# Altium schematic sheet WX0.012.462DL.SchDoc
size A3
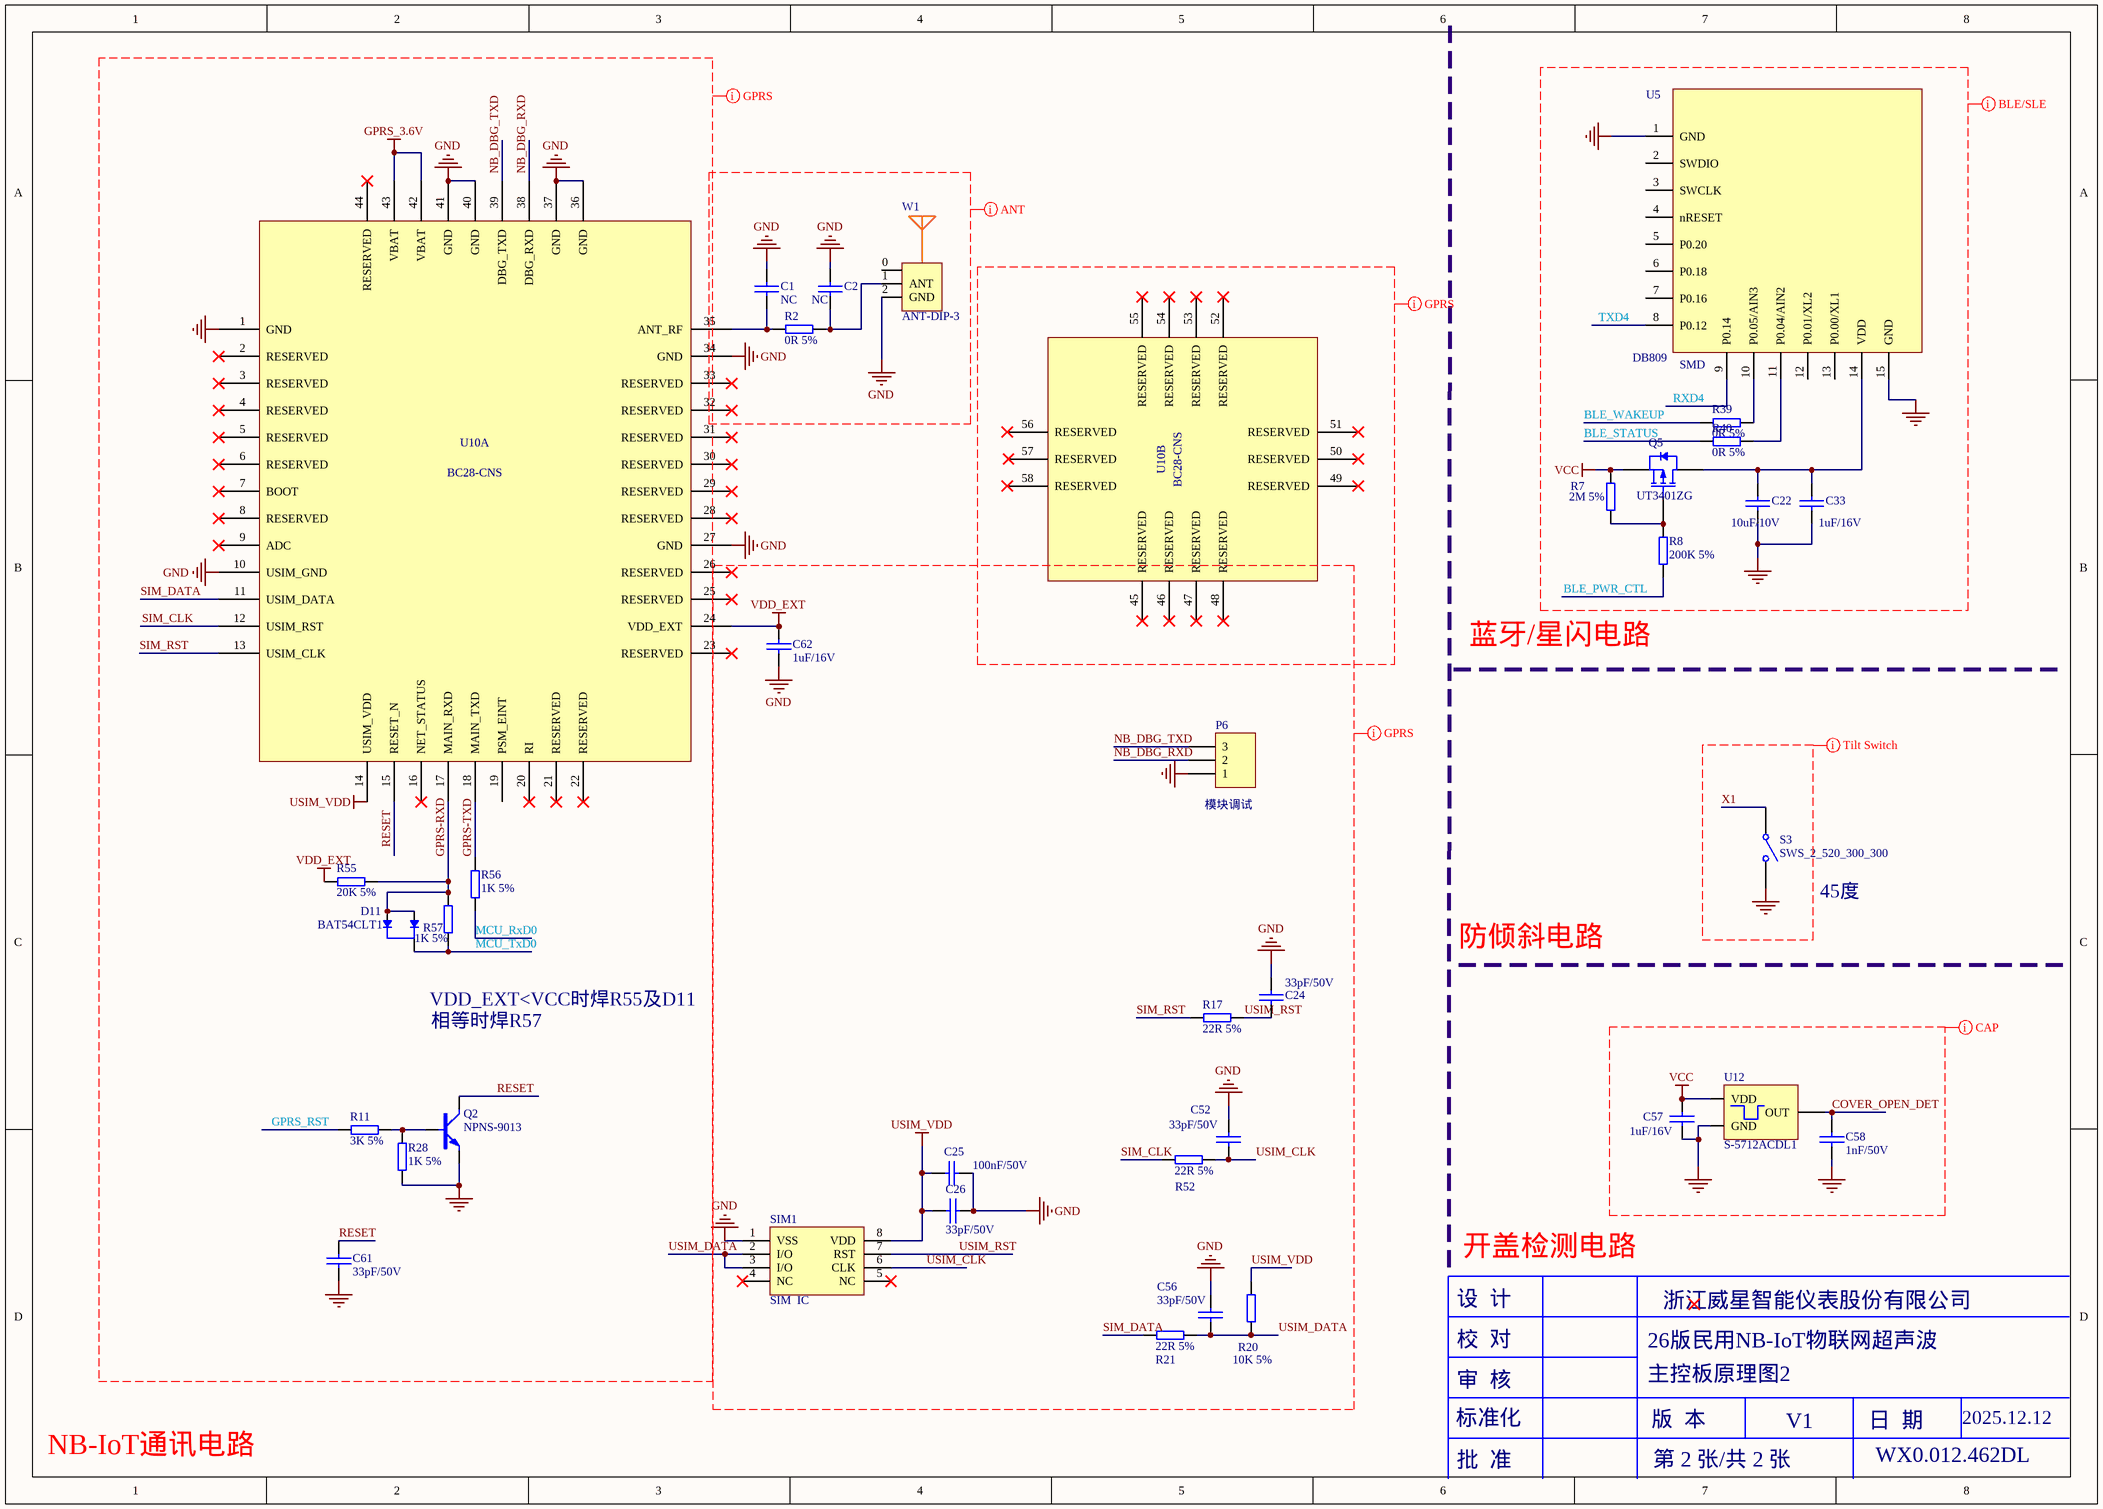
[diagram p0: WX0.012.462DL.SchDoc]

## Parts
C1  NC  [CAP0402]
C2  NC  [CAP0402]
C22  10uF/10V  [CAP0402]
C24  33pF/50V  [CAP0402]
C25  100nF/50V  [CAP0402]
C26  33pF/50V  [CAP0402]
C33  1uF/16V  [CAP0402]
C52  33pF/50V  [CAP0402]
C56  33pF/50V  [CAP0402]
C57  1uF/16V  [CAP0402]
C58  1nF/50V  [CAP0402]
C61  33pF/50V  [CAP0402]
C62  1uF/16V  [CAP0402]
D11  BAT54CLT1  [SOT-23]
P6  模块调试  [PIN254_1*3*WXHJ]
Q2  NPNS-9013  [SOT-323-3_L2.0-W1.3-P1.30-LS2.1-BR]
Q5  UT3401ZG  [SOT-23]
R2  0R 5%  [RES0402]
R7  2M 5%  [RES0402]
R8  200K 5%  [RES0402]
R11  3K 5%  [RES0402]
R17  22R 5%  [RES0402]
R20  10K 5%  [RES0402]
R21  22R 5%  [RES0402]
R28  1K 5%  [RES0402]
R39  0R 5%  [RES0402]
R40  0R 5%  [RES0402]
R52  22R 5%  [RES0402]
R55  20K 5%  [RES0402]
R56  1K 5%  [RES0402]
R57  1K 5%  [RES0402]
S3  SWS_2_520_300_300  [SWS_2_520_300]
SIM1  SIM  IC  [SIMIC]
U5  DB809  SMD/DIP: SMD  [DB809]
U10  BC28-CNS  (parts A,B of 2)
U12  S-5712ACDL1  [SOT-23]
W1  ANT-DIP-3  [ANT-DIP-3]

## Nets
GND: C1.2 C2.2 C22.2 C24.2 C25.1 C26.2 C33.2 C52.2 C56.2 C57.2 C58.2 C61.2 C62.2 P6.1 Q2.2(E) R28.1 S3.2 SIM1.1(VSS) U5.1(GND) U5.15(GND) U10.1(GND) U10.10(USIM_GND) U10.27(GND) U10.34(GND) U10.36(GND) U10.37(GND) U10.40(GND) U10.41(GND) U12.3(GND) W1.2(GND)
GPRS_3.6V: U10.42(VBAT) U10.43(VBAT)
USIM_VDD: C25.2 C26.1 R20.2 SIM1.8(VDD) U10.14(USIM_VDD)
VCC: C57.1 Q5.2(S) R7.2 U12.1(VDD)
VDD_EXT: C62.1 R55.1 U10.24(VDD_EXT)
BLE_PWR_CTL: R8.1
BLE_STATUS: R40.2
BLE_WAKEUP: R39.1
COVER_OPEN_DET: C58.1 U12.2(OUT)
GPRS-RXD: D11.1(A) D11.2(A) R55.2 R57.1 U10.17(MAIN_RXD)
GPRS-TXD: R56.2 U10.18(MAIN_TXD)
GPRS_RST: R11.1
MCU_RxD0: R56.1
MCU_TxD0: D11.3(C) R57.2
NB_DBG_RXD: P6.2 U10.38(DBG_RXD)
NB_DBG_TXD: P6.3 U10.39(DBG_TXD)
RESET: C61.1 Q2.3(C) U10.15(RESET_N)
RXD4: U5.9(P0.14)
SIM_CLK: R52.1 U10.12(USIM_RST)
SIM_DATA: R21.1 U10.11(USIM_DATA)
SIM_RST: R17.1 U10.13(USIM_CLK)
TXD4: U5.8(P0.12)
USIM_CLK: C52.1 R52.2 SIM1.6(CLK)
USIM_DATA: C56.1 R20.1 R21.2 SIM1.2(I/O) SIM1.3(I/O)
USIM_RST: C24.1 R17.2 SIM1.7(RST)
X1: S3.1
NetC1_1: C1.1 R2.2 U10.35(ANT_RF)
NetC2_1: C2.1 R2.1 W1.1(ANT)
NetC22_1: C22.1 C33.1 Q5.3(D) U5.14(VDD)
NetQ2_1: Q2.1(B) R11.2 R28.2
NetQ5_1: Q5.1(G) R7.1 R8.2
NetR39_2: R39.2 U5.10(P0.05/AIN3)
NetR40_1: R40.1 U5.11(P0.04/AIN2)

Not connected (* = marked no-connect by the designer): SIM1 4(NC)* 5(NC)*; U5 2(SWDIO) 3(SWCLK) 4(nRESET) 5(P0.20) 6(P0.18) 7(P0.16) 12(P0.01/XL2) 13(P0.00/XL1); U10 2(RESERVED)* 3(RESERVED)* 4(RESERVED)* 5(RESERVED)* 6(RESERVED)* 7(BOOT)* 8(RESERVED)* 9(ADC)* 16(NET_STATUS)* 19(PSM_EINT) 20(RI)* 21(RESERVED)* 22(RESERVED)* 23(RESERVED)* 25(RESERVED)* 26(RESERVED)* 28(RESERVED)* 29(RESERVED)* 30(RESERVED)* 31(RESERVED)* 32(RESERVED)* 33(RESERVED)* 44(RESERVED)* 45(RESERVED)* 46(RESERVED)* 47(RESERVED)* 48(RESERVED)* 49(RESERVED)* 50(RESERVED)* 51(RESERVED)* 52(RESERVED)* 53(RESERVED)* 54(RESERVED)* 55(RESERVED)* 56(RESERVED)* 57(RESERVED) 58(RESERVED)*; W1 0(NC)

## Layout directives
net class CAP: COVER_OPEN_DET, GND, VCC
net class Tilt Switch: GND, X1
net class BLE/SLE: BLE_PWR_CTL, BLE_STATUS, BLE_WAKEUP, GND, RXD4, TXD4, VCC
net class GPRS: (no net found under the mark), GND, GPRS-RXD, GPRS-TXD, GPRS_3.6V, GPRS_RST, MCU_RxD0, MCU_TxD0, NB_DBG_RXD, NB_DBG_TXD, RESET, SIM_CLK, SIM_DATA, SIM_RST, USIM_CLK, USIM_DATA, USIM_RST, USIM_VDD, VDD_EXT
net class ANT: GND

## Notes on the sheet
- 蓝牙/星闪电路
- 45度
- 防倾斜电路
- VDD_EXT<VCC时焊R55及D11
- 相等时焊R57
- 开盖检测电路
- 设  计
- 浙江威星智能仪表股份有限公司
- 审  核
- 校  对
- 26版民用NB-IoT物联网超声波
- 主控板原理图2
- NB-IoT通讯电路
- 标准化
- 版  本
- V1
- 日  期
- WX0.012.462DL
- 2025.12.12
- 批  准
- 第 2 张/共 2 张

## Library data of the parts
C1 C2 = 101020103-0005: Part Name: 0603贴片电容; ID: 11; SMD/DIP: SMD
C22 = 101020103-0026: 106pF,10 V,±10%,0603,村田,GRM188R61A106KE47D; Part Name: 0603贴片电容; ID: 8; SMD/DIP: SMD; Part Number: 101020103-0026
C24 C26 C52 C56 = 101020103-0027: 33pF,50 V,±10%,0603,国巨,CC0603KRNPO9BN33; Part Name: 0603贴片电容; ID: 17; SMD/DIP: SMD; Part Number: 101020103-0027
C25 = 101020103-0021: 104pF,50 V,±10%,0603,国巨,CC0603KRX7R9BB104; Part Name: 0603贴片电容; ID: 3; SMD/DIP: SMD; Part Number: 101020103-0021
C33 C57 C62 = 101020103-0003: 105pF,16 V,±10%,0603,国巨,CC0603KRX7R7BB105; Part Name: 0603贴片电容; ID: 14; SMD/DIP: SMD; Part Number: 101020103-0003
C58 = 101020103-0022: 102pF,50 V,±10%,0603,国巨,CC0603KRX7R9BB102; Part Name: 0603贴片电容; ID: 13; SMD/DIP: SMD; Part Number: 101020103-0022
C61 = 101020103-0027: 33pF,50 V,±10%,0603,国巨,CC0603KRNPO9BN33; Part Name: 0603贴片电容; ID: 18; SMD/DIP: SMD; Part Number: 101020103-0027
D11 = 101040101-0038: BAT54CLT1，SOT23-3,SOT23-3,0.2 A,0.8 V,30 V,安森美,BAT54CLT1; Part Name: 贴片肖特基; ID: 8; SMD/DIP: SMD; Part Number: 101040101-0038
P6 = AD_WXHJ_PinHeader_04: 1*3 ，Φ1.0 ，2.54mm，直脚,无需焊接器件; Part Name: 排针; ID: 27; SMD/DIP: DIP; Part Number: AD_WXHJ_PinHeader_04
Q2 = 101040201-0002: 9013,NPN,SOT-23,长电,S9013; Part Name: 贴片三极管; ID: 14; SMD/DIP: SMD; Part Number: 101040201-0002
Q5 = 101040201-0013: UT3401ZG,P-MOS,SOT-23,UTC,UT3401ZG; Part Name: 功率MOS管; ID: 18; SMD/DIP: SMD; Part Number: 101040201-0013
R2 R39 R40 = 101010103-0001: 国巨,±5%,0603,,155 ℃,-55 ℃,RC0603J2-070RL,无铅,200 ppm/℃,1/10W,,0R; Part Name: 0603贴片电阻; ID: 1; SMD/DIP: SMD; Part Number: 101010103-0001
R7 = 101010103-0025: 国巨,±5%,0603,,155 ℃,-55 ℃,RC0603JR-072ML,含铅,100 ppm/℃,1/10W,,2M; Part Name: 0603贴片电阻; ID: 20; SMD/DIP: SMD; Part Number: 101010103-0025
R8 = 101010103-0003: 10K±5%,1/10W,0603; Part Name: 0603贴片电阻; ID: 32; Part Number: 101010103-0003
R11 = 101010103-0006: 国巨,±5%,0603,,155 ℃,-55 ℃,RC0603JR-073KL,无铅,100 ppm/℃,1/10W,,3K; Part Name: 0603贴片电阻; ID: 22; SMD/DIP: SMD; Part Number: 101010103-0006
R17 R21 R52 = 101010103-0009: 国巨,±5%,0603,,155 ℃,-55 ℃,RC0603JR-0722RL,无铅,200 ppm/℃,1/10W,,22欧; Part Name: 0603贴片电阻; ID: 18; SMD/DIP: SMD; Part Number: 101010103-0009
R20 = 101010103-0003: 国巨,±5%,0603,,155 ℃,-55 ℃,RC0603JR-0710KL,无铅,200 ppm/℃,1/10W,,10K; Part Name: 0603贴片电阻; ID: 7; SMD/DIP: SMD; Part Number: 101010103-0003
R28 = 101010103-0008: 1K,±5%,1/10W,0603,国巨,RC0603JR-071KL; Part Name: 0603贴片电阻; ID: 10; SMD/DIP: SMD; Part Number: 101010103-0008
R55 = 101010103-0004: 国巨,±5%,0603,,155 ℃,-55 ℃,RC0603JR-0720KL,无铅,200 ppm/℃,1/10W,,20K; Part Name: 0603贴片电阻; ID: 15; SMD/DIP: SMD; Part Number: 101010103-0004
R56 R57 = 101010103-0044: 220K,±5%,1/10W,0603,国巨,RC0603JR-07220KL; Part Name: 0603贴片电阻; ID: 30; SMD/DIP: SMD; Part Number: 101010103-0044
S3 = 1011001-0041: CSX-SEN-645B,垂直45°开关转换,3*5.2mm,360°任意方位倾斜检测,深圳市成晟科技有限公司; Part Number: 1011001-0051; Part Name: 倾斜开关; ID: 33; SMD/DIP: SMD
SIM1 = SIMCARD_1
U5 = 1011402-0194: 北高智蓝牙模块DB809; Part Name: 蓝牙模块; ID: 15; Part Number: 1011402-0194
U10 = BC28-CNS: BC28-CNS Moudle 58Pin 15.8X17.7mm H2.2mm RO; Manufacturer: Quectel; Geometry.Height: 2.2mm; Part Description: BC28-CNS Moudle 58Pin 15.8X17.7mm H2.2mm RO; Value: BC28-CNS
U12 = 1010504-0002: S-5712ACDL1,SOT23-3,3.5 V,1.6 V,2 uA,精工电子,S-5712ACDL1; Part Name: 霍尔元件; ID: 2; SMD/DIP: SMD; Part Number: 1010504-0002